# Altium schematic sheet sensors.SchDoc: Fault-Tolerant Quadcopter
size A; DrawnBy: Vaughn Kottler; Engineer: Vaughn Kottler; Revision: A
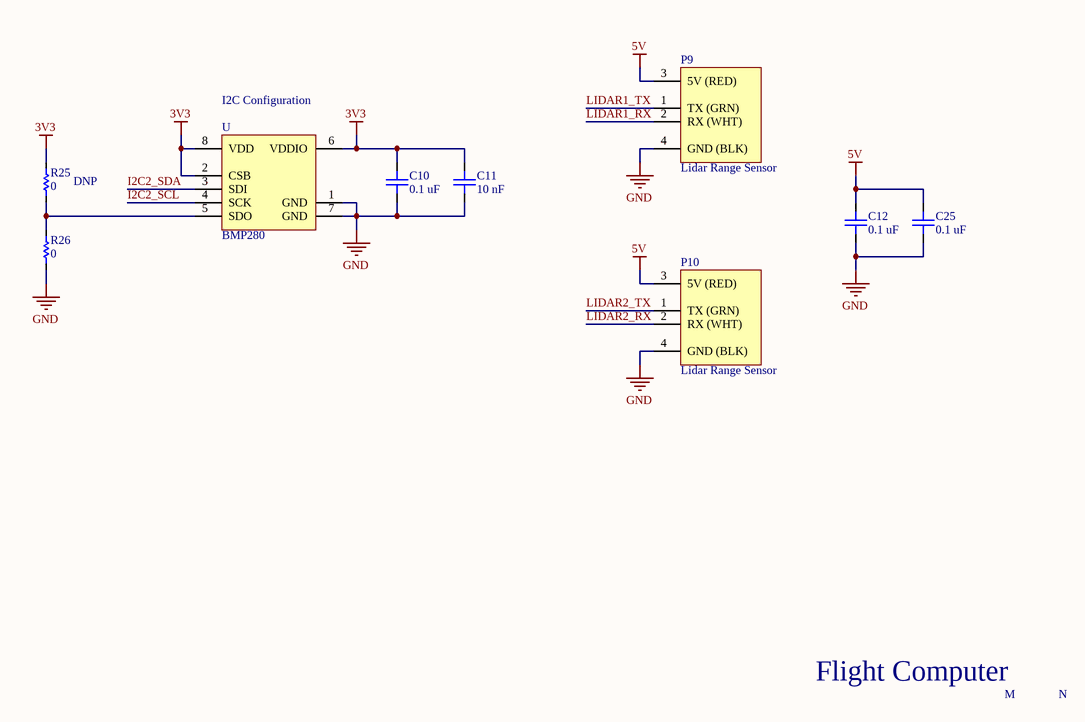
[diagram p0: sensors.SchDoc]

## Parts
C10  0.1 uF  [CAP-CER-0805-SHORT]
C11  10 nF  [CAP-CER-0805-SHORT]
C12  0.1 uF  [CAP-CER-0805-SHORT]
C25  0.1 uF  [CAP-CER-0805-SHORT]
P9  Lidar Range Sensor  [4x1 Shrouded Header 1.25mm]
P10  Lidar Range Sensor  [4x1 Shrouded Header 1.25mm]
R25  0  [RES-0805]
R26  0  [RES-0805]
U  BMP280  [LGA8]

## Nets
3V3: C10.2 C11.2 R25.2 U.2(CSB) U.6(VDDIO) U.8(VDD)
5V: C12.2 C25.2 P9.3(5V_(RED)) P10.3(5V_(RED))
GND: C10.1 C11.1 C12.1 C25.1 P9.4(GND_(BLK)) P10.4(GND_(BLK)) R26.1 U.1(GND) U.7(GND)
I2C2_SCL: U.4(SCK)
I2C2_SDA: U.3(SDI)
LIDAR1_RX: P9.2(RX_(WHT))
LIDAR1_TX: P9.1(TX_(GRN))
LIDAR2_RX: P10.2(RX_(WHT))
LIDAR2_TX: P10.1(TX_(GRN))
NetR25_1: R25.1 R26.2 U.5(SDO)

## Notes on the sheet
- (near U) I2C Configuration
- (near R25) DNP
- Flight Computer
- M
- N

## Library data of the parts
C10 C12 C25 = CAP-CER-0.1uF-25V: ±10%, 0805; ComponentLink1Description: Capacitor Book (Amazon); ComponentLink1URL: https://www.amazon.com/gp/product/B0728HBDRW/
C11 = CAP-CER-10nF-50V: ±10%, 0805; ComponentLink1Description: Capacitor Book (Amazon); ComponentLink1URL: https://www.amazon.com/gp/product/B0728HBDRW/
R25 R26 = RES-0-1/8W: 0805; ComponentLink1Description: Resistor Book (Amazon); ComponentLink1URL: https://www.amazon.com/gp/product/B071J21FYF/
U = BMP280: Digital Pressure Sensor; Supplier 1: Digi-Key; Supplier Part Number 1: 828-1064-6-ND; ComponentLink1Description: Datasheet; ComponentLink1URL: https://ae-bst.resource.bosch.com/media/_tech/media/datasheets/BST-BMP280-DS001-19.pdf
P9 P10 = Lidar Range Sensor: ComponentLink1Description: Amazon; ComponentLink1URL: https://www.amazon.com/gp/product/B075V5TZRY/; Supplier 1: Digi-Key; Supplier Part Number 1: H2201-ND